# EAGLE design Common_slot2 (EAGLE 9.0.0)
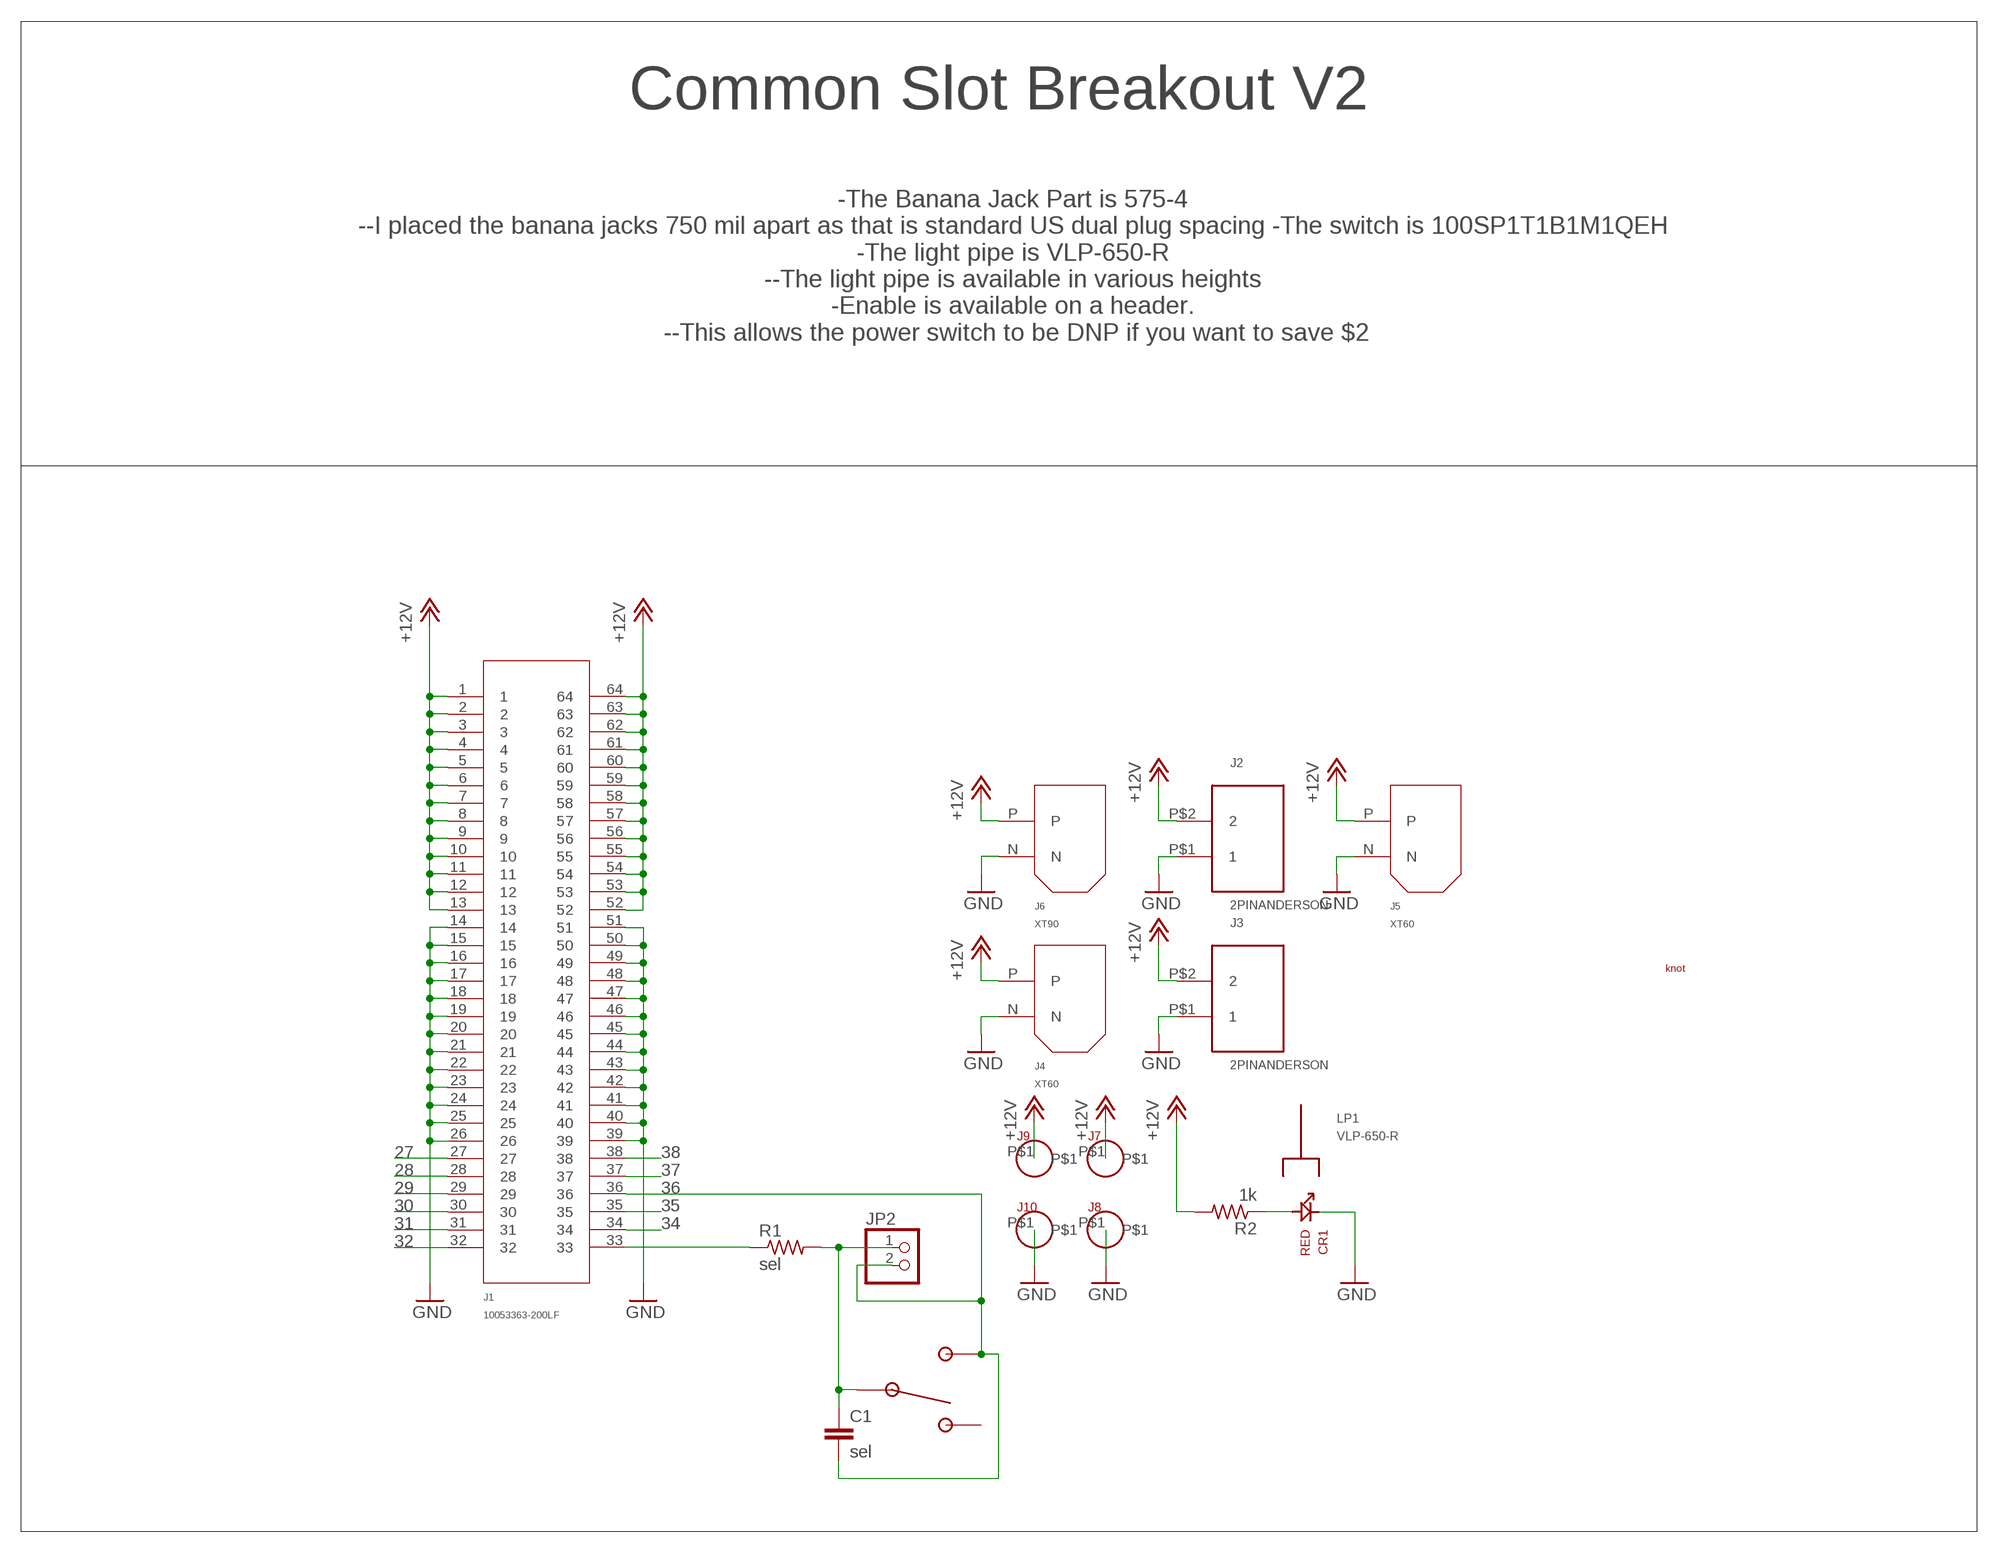
[diagram p0: schematic, sheet 1]

## Parts
C1  sel  0603_CAPACITOR  [0603]
CR1  RED  150060RS75000  [0603_DIODE]
J1  10053363-200LF  [10053363-200LF]
J2  2PINANDERSON  [APP]
J3  2PINANDERSON  [APP]
J4  XT60  [XT60]
J5  XT60  [XT60]
J6  XT90  [XT90]
J7  BANANA  [BANANA]
J8  BANANA  [BANANA]
J9  BANANA  [BANANA]
J10  BANANA  [BANANA]
JP2  PINHD-1X2  [1X02]
LP1  VLP-650-R  [VLP-XXX-R]
R1  sel  0603_RESISTOR  [0603]
R2  1k  0603_RESISTOR  [0603]
SW1  100SP1T1B1M1QEH  [100SP1T1B1M1QEH]
U$1  THIEF_FULL  [THIEF_KNOT]

## Nets
27: J1.27
28: J1.28
29: J1.29
30: J1.30
31: J1.31
32: J1.32
34: J1.34
35: J1.35
36: C1.2 J1.36 JP2.2 SW1.2
37: J1.37
38: J1.38
+12V: J1.1 J1.2 J1.3 J1.4 J1.5 J1.6 J1.7 J1.8 J1.9 J1.10 J1.11 J1.12 J1.13 J1.52 J1.53 J1.54 J1.55 J1.56 J1.57 J1.58 J1.59 J1.60 J1.61 J1.62 J1.63 J1.64 J2.P$2 J3.P$2 J4.P J5.P J6.P J7.P$1 J9.P$1 R2.2
GND: CR1.K J1.14 J1.15 J1.16 J1.17 J1.18 J1.19 J1.20 J1.21 J1.22 J1.23 J1.24 J1.25 J1.26 J1.39 J1.40 J1.41 J1.42 J1.43 J1.44 J1.45 J1.46 J1.47 J1.48 J1.49 J1.50 J1.51 J2.P$1 J3.P$1 J4.N J5.N J6.N J8.P$1 J10.P$1
N$1: J1.33 R1.1
N$2: CR1.A R2.1
N$3: C1.1 JP2.1 R1.2 SW1.C(COM)
Unconnected: SW1.1

## Notes on the sheet
- Common Slot Breakout V2
- -The Banana Jack Part is 575-4 
  --I placed the banana jacks 750 mil apart as that is standard US dual plug spacing -The switch is 100SP1T1B1M1QEH 
  -The light pipe is VLP-650-R 
  --The light pipe is available in various heights 
  -Enable is available on a header. 
  --This allows the power switch to be DNP if you want to save $2

## Library data of the parts
C1 = ruark2:0603_CAPACITOR: 0603 Capacitor -- WARNING: NO DEFINED VALUE OR PART NUMBER
CR1 = ruark2:150060RS75000: Red 625nm LED Indication - Discrete 2V 0603 (1608 Metric); PARTNO: 732-4978-1-ND
J1 = ruark2:10053363-200LF: 64 (Power) Position Female Connector Non Specified - Dual Edge Gold 0.100" (2.54mm) Black; PARTNO: 609-2861-ND
J2 J3 = ruark2:2PINANDERSON
J4 J5 = ruark2:XT60
J6 = ruark2:XT90
J7-J10 = ruark2:BANANA: JACK NON-INSULATED .218" Banana; PARTNO: 36-575-4-ND
JP2 = pinhead:PINHD-1X2: PIN HEADER
LP1 = ruark2:VLP-650-R: Light Pipe Single Clear Rigid Board Mount, Press Fit; PARTNO: 492-2537-ND
R1 = ruark2:0603_RESISTOR: 0603 Resistor -- WARNING: NO DEFINED PART NUMBER OR VALUE
R2 = ruark2:0603_RESISTOR: 0603 Resistor -- WARNING: NO DEFINED PART NUMBER OR VALUE; VALUE: sel
SW1 = ruark2:100SP1T1B1M1QEH: Toggle Switch SPDT Panel Mount; PARTNO: EG2350-ND
U$1 = ruark2:THIEF_FULL; PARTNO: NA

## Board
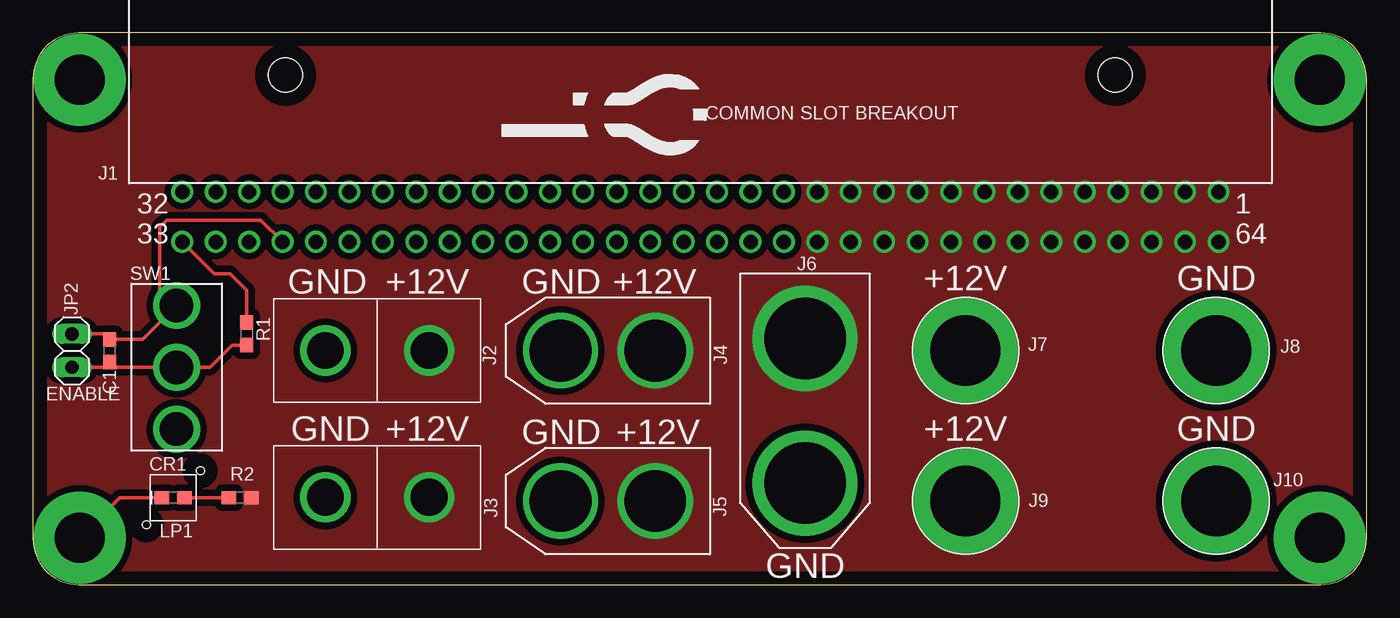
[diagram p1: board, top side]
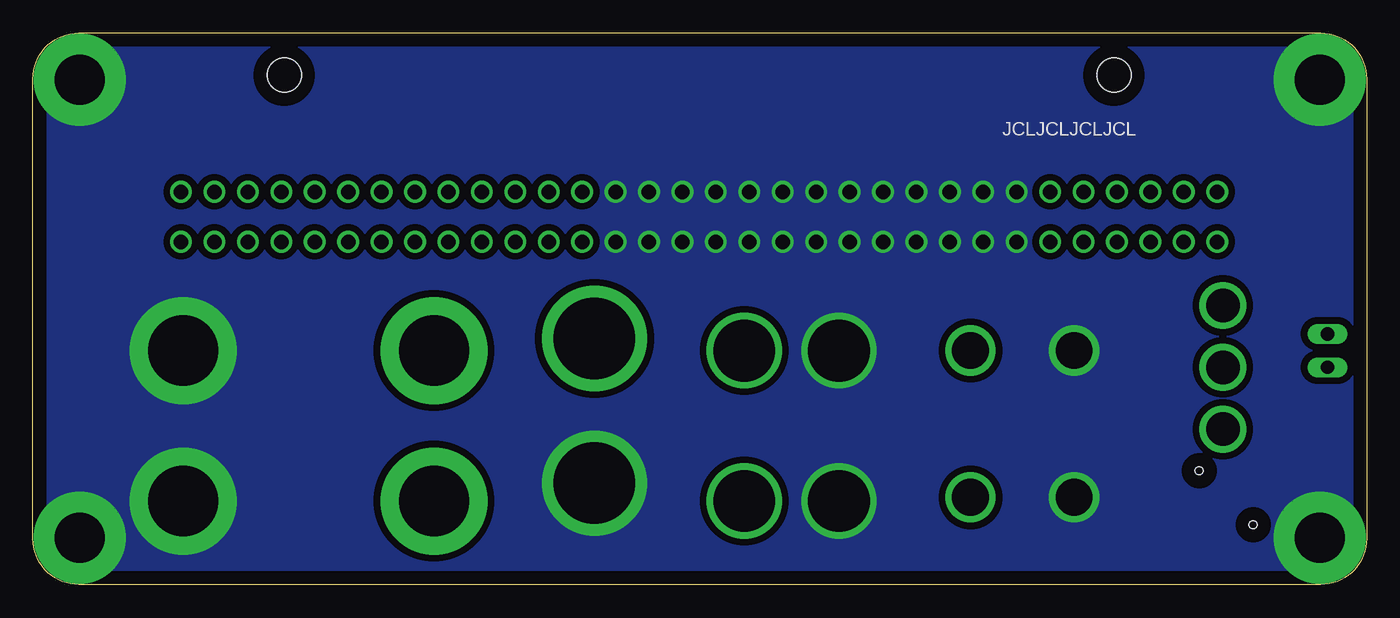
[diagram p2: board, bottom side, seen from below]

Size 101.35 x 41.91 mm. Coordinates in mm from the lower left corner, seen from the top.
Outline: 0,38.42 0,3.49 arc90 3.49,0 97.85,0 arc90 101.35,3.49 101.35,38.42 arc90 97.85,41.91 3.49,41.91 arc90 0,38.42
Copper layers (1*16): Top 0.035mm / dielectric 1.5mm / Bottom 0.035mm
Design rules "default": minimum track width 6mil, minimum drill 0.35mm, track to track 6mil, track to pad 6mil, pad to pad 6mil, via to via 6mil, smd to smd 6mil, copper to edge 40mil, drill to drill 6mil, minimum pad ring 10mil, minimum via ring 8mil, stop-mask expansion 4mil, vias tented up to drill 0mil, thermal gap 10mil

### Footprints (pad centres in the part's own frame; a part is rotated, then mirrored left to right if it is on the bottom)
0603 = smd 1.1 x 1: 1 -0.85,0; 2 0.85,0
0603_DIODE = smd 1.1 x 1: A -0.85,0; K 0.85,0
10053363-200LF = drill 1.1: 1 39.37,1.9; 2 36.83,1.9; 3 34.29,1.9; 4 31.75,1.9; 5 29.21,1.9; 6 26.67,1.9; 7 24.13,1.9; 8 21.59,1.9; 9 19.05,1.9; 10 16.51,1.9; 11 13.97,1.9; 12 11.43,1.9; 13 8.89,1.9; 14 6.35,1.9; 15 3.81,1.9; 16 1.27,1.9; 17 -1.27,1.9; 18 -3.81,1.9; 19 -6.35,1.9; 20 -8.89,1.9; 21 -11.43,1.9; 22 -13.97,1.9; 23 -16.51,1.9; 24 -19.05,1.9; 25 -21.59,1.9; 26 -24.13,1.9; 27 -26.67,1.9; 28 -29.21,1.9; 29 -31.75,1.9; 30 -34.29,1.9; 31 -36.83,1.9; 32 -39.37,1.9; 33 -39.37,-1.9; 34 -36.83,-1.9; 35 -34.29,-1.9; 36 -31.75,-1.9; 37 -29.21,-1.9; 38 -26.67,-1.9; 39 -24.13,-1.9; 40 -21.59,-1.9; 41 -19.05,-1.9; 42 -16.51,-1.9; 43 -13.97,-1.9; 44 -11.43,-1.9; 45 -8.89,-1.9; 46 -6.35,-1.9; 47 -3.81,-1.9; 48 -1.27,-1.9; 49 1.27,-1.9; 50 3.81,-1.9; 51 6.35,-1.9; 52 8.89,-1.9; 53 11.43,-1.9; 54 13.97,-1.9; 55 16.51,-1.9; 56 19.05,-1.9; 57 21.59,-1.9; 58 24.13,-1.9; 59 26.67,-1.9; 60 29.21,-1.9; 61 31.75,-1.9; 62 34.29,-1.9; 63 36.83,-1.9; 64 39.37,-1.9 | hole 2.6: -31.52,10.76; 31.52,10.76
APP = drill 2.794: P$1 3.937,0; P$2 -3.937,0
XT60 = drill 4.7: N 0,3.6; P 0,-3.6
XT90 = drill 6.2 pad 8: N 0,5.5; P 0,-5.5
BANANA = drill 5.334 pad 8.128: P$1 0,0
1X02 = drill 1.016 long: 1 -1.27,0; 2 1.27,0
VLP-XXX-R = hole 0.61: 2.05,2.05; -2.05,-2.05
100SP1T1B1M1QEH = drill 2.54: 1 0,4.699; 2 0,-4.699; C 0,0

### Placement (x,y rotation side)
C1  5.84,17.78 90 top
CR1  10.67,6.6 180 top
J1  50.72,27.94 0 top
J2  26.16,17.78 180 top
J3  26.16,6.63 180 top
J4  43.69,17.78 90 top
J5  43.69,6.35 90 top
J6  58.67,13.21 180 top
J7  70.87,17.78 0 top
J8  89.92,17.78 0 top
J9  70.87,6.35 0 top
J10  89.92,6.35 0 top
JP2  2.97,17.78 90 top
LP1  10.67,6.6 0 top
R1  16.26,19.05 270 top
R2  15.75,6.6 0 top
SW1  10.92,16.51 180 top
U$1  34.8,30.99 0 top

### Tracks (layer width: path | path; a pad name or v marks a point on that pad's centre or on a via)
36
  Top 0.254: JP2.2 5.42,19.05 C1.2 8.34,18.63 10.86,21.14 | 10.86,21.14 SW1.2 | J1.36 17.32,27.69 10.16,27.69 9.65,27.18 9.65,22.35 10.86,21.14
+12V
  pour Top (isolate 0.508, no thermals): 0.51,0 0.51,41.91 100.33,41.91 100.33,0
GND  (via drill 3.81 pad 6.99)
  Top 0.254: CR1.K 6.6,6.6 v3.56,3.56
  other vias: 3.56,38.35 97.79,38.35 97.79,3.56
  pour Bottom (isolate 0.508, no thermals): 0.76,0 0.76,41.91 100.33,41.91 100.33,0
N$1
  Top 0.254: R1.1 16.26,22.35 14.99,23.62 13.77,23.62 J1.33
N$2
  Top 0.254: R2.1 CR1.A
N$3
  Top 0.254: 16.31,18.15 R1.2 15.15,18.2 13.46,16.51 SW1.C 5.84,16.51 | 5.84,16.51 JP2.1 | C1.1 5.84,16.51

### Text on the board
tPlace: GND | +12V | GND | +12V | +12V | GND | GND | +12V | GND | +12V | +12V | GND | GND
tNames: COMMON SLOT BREAKOUT | ENABLE
bNames: JCLJCLJCLJCL
tStop: MMXX